# EAGLE design Arduino_MEGA_2560-Rev3- Shield (EAGLE 7.5.0)
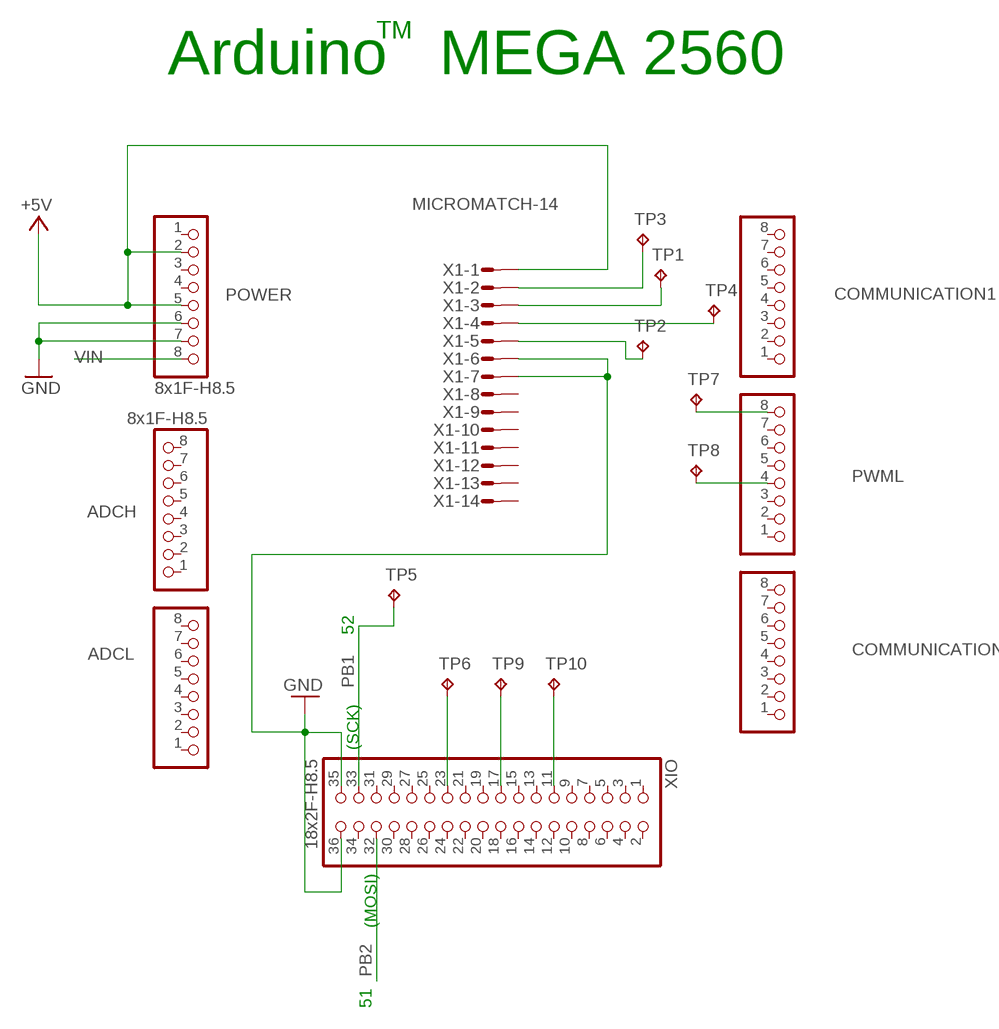
[diagram p0: schematic, sheet 1]

## Parts
ADCH  8x1F-H8.5  PINHD-1X8  [1X08]
ADCL  8x1F-H8.5  PINHD-1X8  [1X08]
COMMUNICATION  8x1F-H8.5  PINHD-1X8  [1X08]
COMMUNICATION1  8x1F-H8.5  PINHD-1X8  [1X08]
POWER  8x1F-H8.5  PINHD-1X8  [1X08]
PWML  8x1F-H8.5  PINHD-1X8  [1X08]
TP1  TPPAD1-13  [P1-13]
TP2  TPPAD1-13  [P1-13]
TP3  TPPAD1-13  [P1-13]
TP4  TPPAD1-13  [P1-13]
TP5  TPPAD1-13  [P1-13]
TP6  TPPAD1-13  [P1-13]
TP7  TPPAD1-13  [P1-13]
TP8  TPPAD1-13  [P1-13]
TP9  TPPAD1-13  [P1-13]
TP10  TPPAD1-13  [P1-13]
X1  MICROMATCH-14  [MICROMATCH-14]
XIO  18x2F-H8.5  PINHD-2X18  [2X18]

## Nets
+5V [power usb]: POWER.2 POWER.5 X1.1
GND [gnd]: POWER.6 POWER.7 X1.6 X1.7 XIO.35 XIO.36
N$1: TP1.TP X1.3
N$2: TP4.TP X1.4
N$3: TP3.TP X1.2
N$4: TP2.TP X1.5
N$5: PWML.8 TP7.TP
N$6: PWML.4 TP8.TP
N$7: TP6.TP XIO.23
N$8: TP9.TP XIO.17
N$9: TP10.TP XIO.11
PB1: TP5.TP XIO.33
PB2: XIO.32
VIN [power]: POWER.8
Unconnected: ADCH.1 ADCH.2 ADCH.3 ADCH.4 ADCH.5 ADCH.6 ADCH.7 ADCH.8 ADCL.1 ADCL.2 ADCL.3 ADCL.4 ADCL.5 ADCL.6 ADCL.7 ADCL.8 COMMUNICATION1.1 COMMUNICATION1.2 COMMUNICATION1.3 COMMUNICATION1.4 COMMUNICATION1.5 COMMUNICATION1.6 COMMUNICATION1.7 COMMUNICATION1.8 COMMUNICATION.1 COMMUNICATION.2 COMMUNICATION.3 COMMUNICATION.4 COMMUNICATION.5 COMMUNICATION.6 COMMUNICATION.7 COMMUNICATION.8 POWER.1 POWER.3 POWER.4 PWML.1 PWML.2 PWML.3 PWML.5 PWML.6 PWML.7 X1.8 X1.9 X1.10 X1.11 X1.12 X1.13 X1.14 XIO.1 XIO.2 XIO.3 XIO.4 XIO.5 XIO.6 XIO.7 XIO.8 XIO.9 XIO.10 XIO.12 XIO.13 XIO.14 XIO.15 XIO.16 XIO.18 XIO.19 XIO.20 XIO.21 XIO.22 XIO.24 XIO.25 XIO.26 XIO.27 XIO.28 XIO.29 XIO.30 XIO.31 XIO.34

## Notes on the sheet
- TM
- Arduino   MEGA 2560
- 52
- (SCK)
- (MOSI)
- 51

## Library data of the parts
ADCH ADCL COMMUNICATION COMMUNICATION1 POWER PWML = SmartPrj:PINHD-1X8: PIN HEADER
TP1-TP10 = testpad:TP: Test pad
X1 = con-amp-micromatch:MICROMATCH-14: MicroMaTch 14 8-215464-4 / 1-215464-4 Drawing Number C-215464 DDEController.pdf; MF: FARNELL; MPN: 8-215464-4; OC_FARNELL: 3784678; OC_NEWARK: 19J6431
XIO = SmartPrj:PINHD-2X18: PIN HEADER

## Net classes
0 default: width 0.203 mm, drill 0.406 mm, clearance 0.203 mm
1 power: width 0.61 mm, drill 0.406 mm, clearance 0.203 mm
2 gnd: width 0.305 mm, drill 0.406 mm, clearance 0.203 mm
3 power usb: width 0.508 mm, drill 0.406 mm, clearance 0.203 mm

## Board
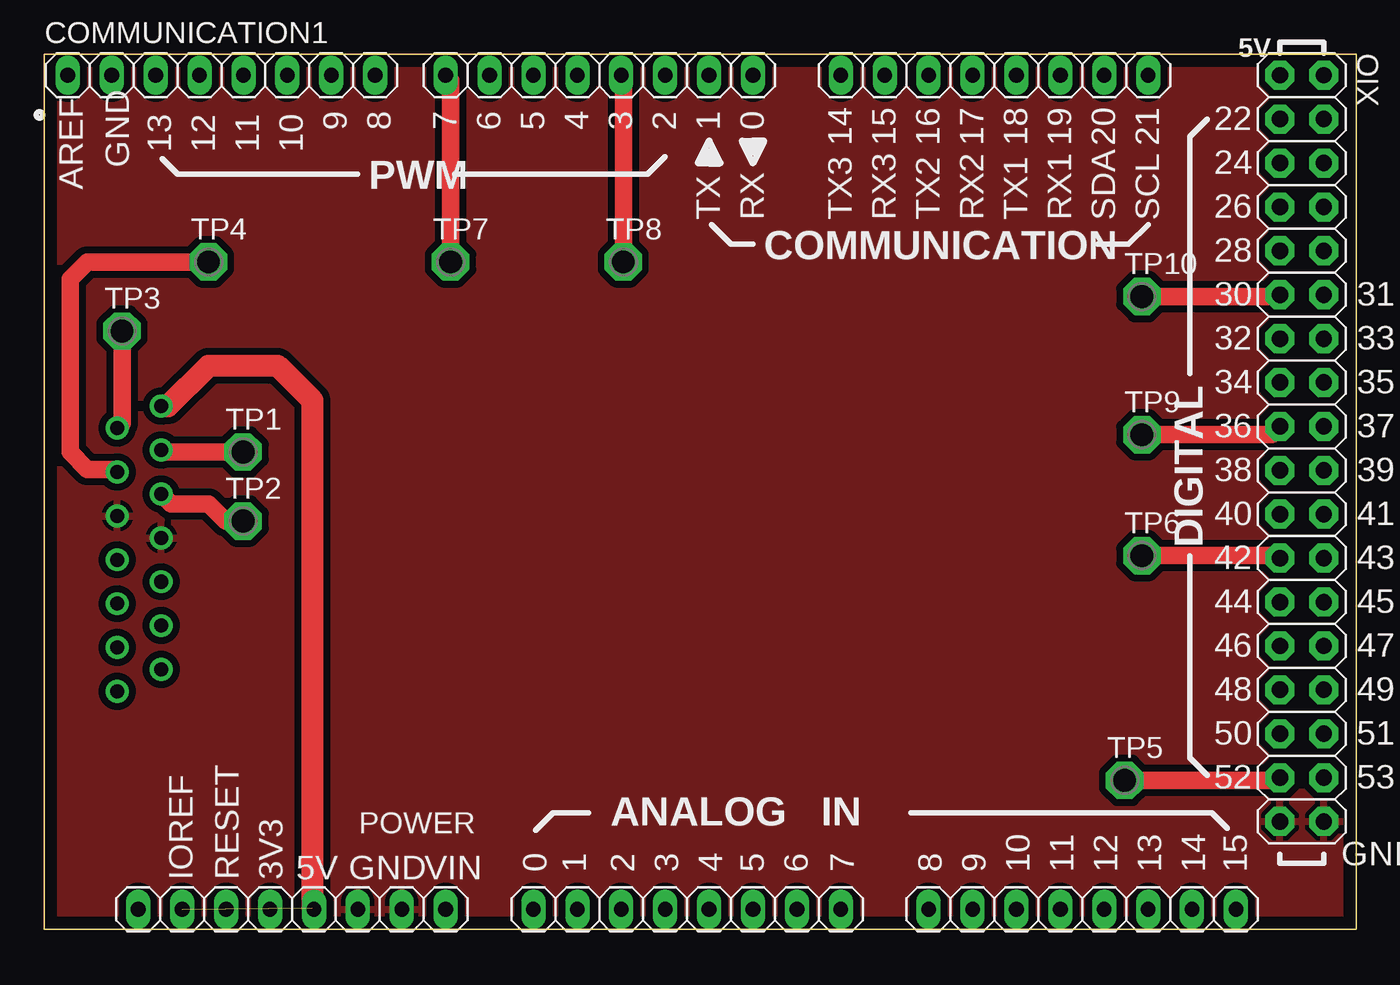
[diagram p1: board, top side]
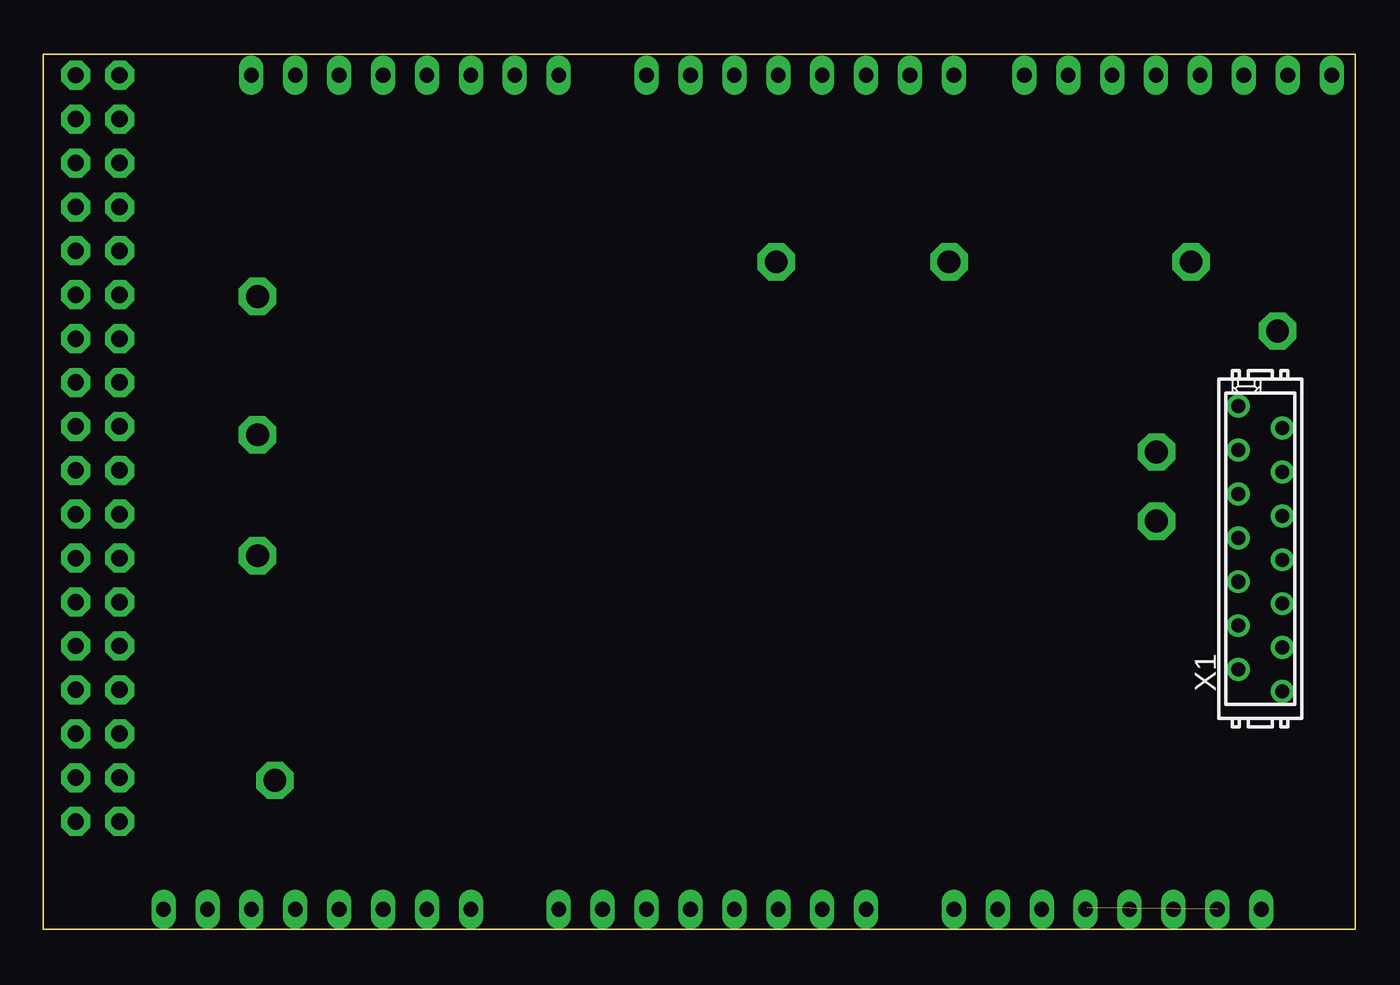
[diagram p2: board, bottom side, seen from below]

Size 75.9 x 50.6 mm. Coordinates in mm from the lower left corner, seen from the top.
Outline: 0,0 0,50.6 75.9,50.6 75.9,0 0,0
Copper layers (1*16): Top 0.035mm / dielectric 1.5mm / Bottom 0.035mm
Design rules "default *": minimum track width 8mil, minimum drill 16mil, track to track 16mil, track to pad 16mil, pad to pad 16mil, via to via 16mil, smd to smd 16mil, copper to edge 27mil, drill to drill 20mil, minimum pad ring 10mil, minimum via ring 10mil, stop-mask expansion 2mil, vias tented up to drill 24mil, thermal gap 10mil

### Footprints (pad centres in the part's own frame; a part is rotated, then mirrored left to right if it is on the bottom)
1X08 = drill 0.85 pad 1.422 long: 1 -8.89,0; 2 -6.35,0; 3 -3.81,0; 4 -1.27,0; 5 1.27,0; 6 3.81,0; 7 6.35,0; 8 8.89,0
P1-13 = drill 1.321 pad 2.159 octagon: TP 0,0
MICROMATCH-14 = drill 0.813: 1 8.255,1.27; 2 6.985,-1.27; 3 5.715,1.27; 4 4.445,-1.27; 5 3.175,1.27; 6 1.905,-1.27; 7 0.635,1.27; 8 -0.635,-1.27; 9 -1.905,1.27; 10 -3.175,-1.27; 11 -4.445,1.27; 12 -5.715,-1.27; 13 -6.985,1.27; 14 -8.255,-1.27
2X18 = drill 0.95 pad 1.676 octagon: 1 -21.59,-1.27; 2 -21.59,1.27; 3 -19.05,-1.27; 4 -19.05,1.27; 5 -16.51,-1.27; 6 -16.51,1.27; 7 -13.97,-1.27; 8 -13.97,1.27; 9 -11.43,-1.27; 10 -11.43,1.27; 11 -8.89,-1.27; 12 -8.89,1.27; 13 -6.35,-1.27; 14 -6.35,1.27; 15 -3.81,-1.27; 16 -3.81,1.27; 17 -1.27,-1.27; 18 -1.27,1.27; 19 1.27,-1.27; 20 1.27,1.27; 21 3.81,-1.27; 22 3.81,1.27; 23 6.35,-1.27; 24 6.35,1.27; 25 8.89,-1.27; 26 8.89,1.27; 27 11.43,-1.27; 28 11.43,1.27; 29 13.97,-1.27; 30 13.97,1.27; 31 16.51,-1.27; 32 16.51,1.27; 33 19.05,-1.27; 34 19.05,1.27; 35 21.59,-1.27; 36 21.59,1.27

### Placement (x,y rotation side)
ADCH  60.05,1.14 0 top
ADCL  37.19,1.14 0 top
COMMUNICATION  54.97,49.4 180 top
COMMUNICATION1  10.25,49.4 0 top
POWER  14.33,1.14 0 top
PWML  32.11,49.4 180 top
TP1  11.5,27.6 0 top
TP2  11.5,23.6 0 top
TP3  4.5,34.6 0 top
TP4  9.5,38.6 0 top
TP5  62.5,8.6 0 top
TP6  63.5,21.6 0 top
TP7  23.5,38.6 0 top
TP8  33.5,38.6 0 top
TP9  63.5,28.6 0 top
TP10  63.5,36.6 0 top
X1  5.5,22 90 bottom
XIO  72.75,27.81 270 top

### Tracks (layer width: path | path; a pad name or v marks a point on that pad's centre or on a via)
+5V  (1 unrouted)
  Top 1.27: X1.1 7.16,30.26 9.5,32.6 13.5,32.6 15.5,30.6 15.5,1.24 POWER.5
GND
  pour Top: -0.5,50.6 -0.5,-0.4 76.5,-0.4 76.5,50.6
N$1
  Top 1: TP1.TP 6.89,27.6 X1.3
N$2
  Top 1: TP4.TP 2.5,38.6 1.5,37.6 1.5,27.6 2.5,26.6 4.07,26.6 X1.4
N$3
  Top 1: TP3.TP 4.5,29.26 X1.2
N$4
  Top 1: TP2.TP 10.5,23.6 9.5,24.6 7.34,24.6 X1.5
N$5
  Top 1: TP7.TP 23.5,49.12 PWML.8
N$6
  Top 1: TP8.TP 33.5,49.28 PWML.4
N$7
  Top 1: TP6.TP 71.34,21.6 XIO.23
N$8
  Top 1: TP9.TP 71,28.6 XIO.17
N$9
  Top 1: TP10.TP 71.38,36.6 XIO.11
PB1
  Top 1: TP5.TP 71.32,8.6 XIO.33

### Text on the board
tPlace: 9 | 8 | 7 | 6 | 5 | 4 | 3 | 2 | 1 | 0 | 22 | 14 | 15 | 16 | 17 | 18 | 19 | 20 | 21 | 13 | 12 | 11 | 10 | 24 | 26 | 28 | 30 | 31 | 32 | 33 | 34 | 35 | 36 | 37 | 38 | 39 | 40 | 41 | 42 | 43 | 44 | 45 | 46 | 47 | 48 | 49 | 50 | 51 | 52 | 53 | 0 | 1 | 2 | 3 | 4 | 5 | 6 | 7 | 8 | 9 | 10 | 11 | 12 | 13 | 14 | 15
tNames: 5V | GND | AREF | PWM | TX | RX | TX3 | RX3 | TX2 | RX2 | TX1 | RX1 | SDA | SCL | DIGITAL | ANALOG IN | GND | IOREF | RESET | 3V3 | 5V | GND | VIN